# Altium project FIT_PM_Digital_Readout_test_board.PrjPcb (part 1 of 4)
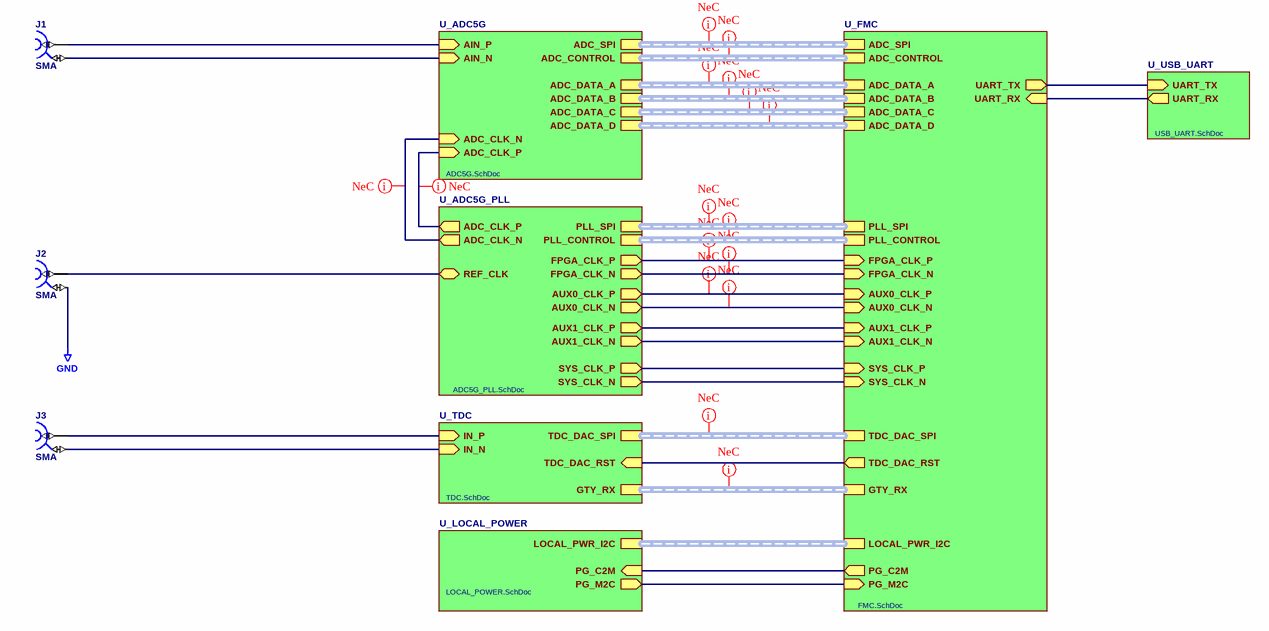
[diagram p0: TOP.SchDoc]
13 sheets, 495 parts. Net scope: hierarchical (ports join the sheet entries above them; power ports are global).
Board file: FIT_TDC_ADC.PcbDoc
Sheets:
  TOP.SchDoc
    U_ADC5G = ADC5G.SchDoc
      U_ADC5G_POWER = ADC5G_POWER.SchDoc
      U_ADC5G_FRONTEND = ADC5G_FRONTEND.SchDoc
      U_ADC5G_DIGITALIO = ADC5G_DIGITALIO.SchDoc
    U_ADC5G_PLL = ADC5G_PLL.SchDoc
    U_FMC = FMC.SchDoc
      U_FMC_EEPROM = FMC_EEPROM.SchDoc
    U_TDC = TDC.SchDoc
      TDC_DL_CH1 = TDC_CH.SchDoc
      TDC_DL_CH2 = TDC_CH.SchDoc
      TDC_DL_CH3 = TDC_CH.SchDoc
      TDC_DL_CH4 = TDC_CH.SchDoc
      TDC_DL_CH5 = TDC_CH.SchDoc
      TDC_DL_CH6 = TDC_CH.SchDoc
      TDC_DL_CH7 = TDC_CH.SchDoc
      TDC_DL_CH8 = TDC_CH.SchDoc
      U_TDC_VTUNE_DAC = TDC_VTUNE_DAC.SchDoc
    U_LOCAL_POWER = LOCAL_POWER.SchDoc
    U_USB_UART = USB_UART.SchDoc

## Sheet TOP.SchDoc: FMC 5GS/s ADC/TDC
size 420 x 297 mm; Author: Agnieszka Bartkowicz; CompanyName: WUT ISE; DrawnBy: Agnieszka Bartkowicz; Engineer: Agnieszka Bartkowicz; Organization: WUT ISE; Address1: PW ISE; Address2: Nowowiejska 15/19 00-665 Warsaw; Address3: gyorka@o2.pl; SheetNumber: 1; SheetTotal: 14; ModifiedBy: -; CheckedDate: -; Title2: Title 2; DivGrp: WUT ISE; Designer: A. Bartkowicz

### Parts
J1  SMA  [SAMTEC_SMA-J-P-H-RA-TH1]
J2  SMA  [SAMTEC_SMA-J-P-H-RA-TH1]
J3  SMA  [SAMTEC_SMA-J-P-H-RA-TH1]

### Sub-sheets
U_ADC5G = ADC5G.SchDoc: ADC_SPI (harness SPI), ADC_CONTROL (harness ADC_CONTROL), ADC_CLK_P (in), ADC_CLK_N (in), ADC_DATA_A (harness ADC_DATA), ADC_DATA_B (harness ADC_DATA), ADC_DATA_C (harness ADC_DATA), ADC_DATA_D (harness ADC_DATA), AIN_N (in), AIN_P (in)
U_ADC5G_PLL = ADC5G_PLL.SchDoc: ADC_CLK_P (out), ADC_CLK_N (out), PLL_SPI (harness PLL_SPI), PLL_CONTROL (harness PLL_CONTROL), FPGA_CLK_P (out), FPGA_CLK_N (out), SYS_CLK_P (out), SYS_CLK_N (out), REF_CLK (bidir), AUX0_CLK_P (out), AUX0_CLK_N (out), AUX1_CLK_P (out), AUX1_CLK_N (out)
U_FMC = FMC.SchDoc: ADC_DATA_A (harness ADC_DATA), ADC_DATA_B (harness ADC_DATA), ADC_DATA_D (harness ADC_DATA), ADC_DATA_C (harness ADC_DATA), ADC_SPI (harness SPI), ADC_CONTROL (harness ADC_CONTROL), PLL_SPI (harness PLL_SPI), PLL_CONTROL (harness PLL_CONTROL), TDC_DAC_SPI (harness SPI), GTY_RX (harness GTY_RX), FPGA_CLK_P (in), FPGA_CLK_N (in), AUX0_CLK_P (in), AUX0_CLK_N (in), PG_M2C (in), PG_C2M (out), AUX1_CLK_N (in), AUX1_CLK_P (in), SYS_CLK_P (in), SYS_CLK_N (in), LOCAL_PWR_I2C (harness I2C), UART_TX (out), UART_RX (in), TDC_DAC_RST (out)
U_LOCAL_POWER = LOCAL_POWER.SchDoc: PG_C2M (in), PG_M2C (out), LOCAL_PWR_I2C (harness I2C)
U_TDC = TDC.SchDoc: TDC_DAC_SPI (harness I2C), IN_P (in), IN_N (in), GTY_RX (harness GTY_RX), TDC_DAC_RST (in)
U_USB_UART = USB_UART.SchDoc: UART_TX (in), UART_RX (out)

### Nets
GND: J2.2
ADC_CLK_N: sheet U_ADC5G/ADC_CLK_N, sheet U_ADC5G_PLL/ADC_CLK_N
ADC_CLK_P: sheet U_ADC5G/ADC_CLK_P, sheet U_ADC5G_PLL/ADC_CLK_P
AIN_N: J1.2 ; sheet U_ADC5G/AIN_N
AIN_P: J1.1 ; sheet U_ADC5G/AIN_P
CARRIER_PWRON: sheet U_FMC/PG_C2M, sheet U_LOCAL_POWER/PG_C2M
CLK0_M2C_N: sheet U_ADC5G_PLL/AUX0_CLK_N, sheet U_FMC/AUX0_CLK_N
CLK0_M2C_P: sheet U_ADC5G_PLL/AUX0_CLK_P, sheet U_FMC/AUX0_CLK_P
CLK1_M2C_N: sheet U_ADC5G_PLL/AUX1_CLK_N, sheet U_FMC/AUX1_CLK_N
CLK1_M2C_P: sheet U_ADC5G_PLL/AUX1_CLK_P, sheet U_FMC/AUX1_CLK_P
CLK2_BIDIR_N: sheet U_ADC5G_PLL/SYS_CLK_N, sheet U_FMC/SYS_CLK_N
CLK2_BIDIR_P: sheet U_ADC5G_PLL/SYS_CLK_P, sheet U_FMC/SYS_CLK_P
DIN_N: J3.2 ; sheet U_TDC/IN_N
DIN_P: J3.1 ; sheet U_TDC/IN_P
GBTCLK0_M2C_N: sheet U_ADC5G_PLL/FPGA_CLK_N, sheet U_FMC/FPGA_CLK_N
GBTCLK0_M2C_P: sheet U_ADC5G_PLL/FPGA_CLK_P, sheet U_FMC/FPGA_CLK_P
HA22_P: sheet U_FMC/TDC_DAC_RST, sheet U_TDC/TDC_DAC_RST
LA20_P: sheet U_FMC/UART_RX, sheet U_USB_UART/UART_RX
LA25_P: sheet U_FMC/UART_TX, sheet U_USB_UART/UART_TX
PG_M2C: sheet U_FMC/PG_M2C, sheet U_LOCAL_POWER/PG_M2C
NetC102_1: J2.1 ; sheet U_ADC5G_PLL/REF_CLK

### Buses and harness runs
harness sheet U_ADC5G/ADC_CONTROL = sheet U_FMC/ADC_CONTROL
harness sheet U_ADC5G/ADC_DATA_A = sheet U_FMC/ADC_DATA_A
harness sheet U_ADC5G/ADC_DATA_B = sheet U_FMC/ADC_DATA_B
harness sheet U_ADC5G/ADC_DATA_C = sheet U_FMC/ADC_DATA_C
harness sheet U_ADC5G/ADC_DATA_D = sheet U_FMC/ADC_DATA_D
harness sheet U_ADC5G/ADC_SPI = sheet U_FMC/ADC_SPI
harness sheet U_ADC5G_PLL/PLL_CONTROL = sheet U_FMC/PLL_CONTROL
harness sheet U_ADC5G_PLL/PLL_SPI = sheet U_FMC/PLL_SPI
harness sheet U_FMC/GTY_RX = sheet U_TDC/GTY_RX
harness sheet U_FMC/LOCAL_PWR_I2C = sheet U_LOCAL_POWER/LOCAL_PWR_I2C
harness sheet U_FMC/TDC_DAC_SPI = sheet U_TDC/TDC_DAC_SPI

### Layout directives
net class ADC_SPI: (no net found under the mark)
net class ADC_CONTROL: (no net found under the mark)
net class ADC_DATA_A: (no net found under the mark)
net class ADC_DATA_B: (no net found under the mark)
net class ADC_DATA_C: (no net found under the mark)
net class ADC_DATA_D: (no net found under the mark)
net class PLL_SPI: (no net found under the mark)
net class PLL_CONTROL: (no net found under the mark)
net class CLOCKS: ADC_CLK_N, ADC_CLK_P, CLK0_M2C_N, CLK0_M2C_P, GBTCLK0_M2C_N, GBTCLK0_M2C_P
net class TRANSCIVERS: (no net found under the mark)
net class I2C: (no net found under the mark)

### Notes on the sheet
- Project/Equipment
- Document
- Designer
- Drawn by
- Check.by
- Copyright WUT ISE 2024.
  This documentation describes Open Hardware and is licensed under the CERN OHL v.2. You may redistribute and modify this documentation under the terms of the CERN OHL v.2. (http://ohwr.org/CERNOHL). This documentation is distributed WITHOUT ANY EXPRESS OR IMPLIED WARRANTY, INCLUDING OF MERCHANTABILITY, SATISFACTORY QUALITY AND FITNESS FOR A PARTICULAR PURPOSE. Please see the CERN OHL v.2 for applicable conditions.
- Contact
- File
- Last Mod.
- Print Date
- Sheet
- Size
- A3
- of
- Rev

### Library data of the parts
J1-J3 = SAMTEC_SMA-J-P-H-RA-TH1: Part Description: 50 Ohms SMA Right Angle Through-hole PCB Jack; Manufacturer: SAMTEC; PressFit: No; Part Number: SAMTEC_SMA-J-P-H-RA-TH1; Component Kind: Standard; Component Type: Standard; Pin Count: 5; Family: SMA; Mounted: Yes; Socket: No; SMD: No; Sense: No; Status: None; Manufacturer Part Number: SMA-J-P-H-RA-TH1; ComponentHeight: 13.8mm; HelpURL: \\cern.ch\dfs\Applications\Altium\Datasheets\SAMTEC_SMA-J-P-H-RA-TH1.pdf; Author: CERN DEM BC; CreateDate: 11.01.2021; LatestRevisionDate: 11.01.2021

## Sheet ADC5G.SchDoc: FMC 5GS/s ADC/TDC
size 420 x 297 mm; Author: Agnieszka Bartkowicz; CompanyName: WUT ISE; DrawnBy: Agnieszka Bartkowicz; Engineer: Agnieszka Bartkowicz; Organization: WUT ISE; Address1: PW ISE; Address2: Nowowiejska 15/19 00-665 Warsaw; Address3: gyorka@o2.pl; SheetNumber: 2; SheetTotal: 13; ModifiedBy: -; CheckedDate: -; Title2: Title 2; DivGrp: WUT ISE; Designer: A. Bartkowicz
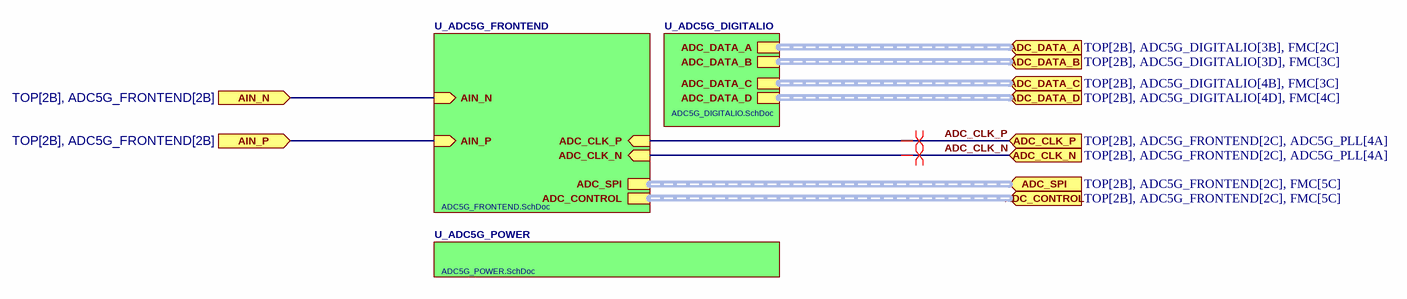
[diagram p1: ADC5G.SchDoc]

### Sub-sheets
U_ADC5G_DIGITALIO = ADC5G_DIGITALIO.SchDoc: ADC_DATA_A (harness ADC_DATA), ADC_DATA_B (harness ADC_DATA), ADC_DATA_D (harness ADC_DATA), ADC_DATA_C (harness ADC_DATA)
U_ADC5G_FRONTEND = ADC5G_FRONTEND.SchDoc: AIN_N (in), AIN_P (in), ADC_CLK_P (in), ADC_CLK_N (in), ADC_SPI (harness SPI), ADC_CONTROL (harness ADC_CONTROL)
U_ADC5G_POWER = ADC5G_POWER.SchDoc: no entries

### Ports
ADC_CLK_N (in, see TOP[2B], ADC5G_FRONTEND[2C], ADC5G_PLL[4A]), ADC_CLK_P (in, see TOP[2B], ADC5G_FRONTEND[2C], ADC5G_PLL[4A]), ADC_CONTROL (in, harness ADC_CONTROL, see TOP[2B], ADC5G_FRONTEND[2C], FMC[5C]), ADC_DATA_A (in, harness ADC_DATA, see TOP[2B], ADC5G_DIGITALIO[3B], FMC[2C]), ADC_DATA_B (in, harness ADC_DATA, see TOP[2B], ADC5G_DIGITALIO[3D], FMC[3C]), ADC_DATA_C (in, harness ADC_DATA, see TOP[2B], ADC5G_DIGITALIO[4B], FMC[3C]), ADC_DATA_D (in, harness ADC_DATA, see TOP[2B], ADC5G_DIGITALIO[4D], FMC[4C]), ADC_SPI (in, harness SPI, see TOP[2B], ADC5G_FRONTEND[2C], FMC[5C]), AIN_N (in, see TOP[2B], ADC5G_FRONTEND[2B]), AIN_P (in, see TOP[2B], ADC5G_FRONTEND[2B])

### Nets
ADC_CLK_N: port ADC_CLK_N, sheet U_ADC5G_FRONTEND/ADC_CLK_N
ADC_CLK_P: port ADC_CLK_P, sheet U_ADC5G_FRONTEND/ADC_CLK_P
AIN_N: port AIN_N, sheet U_ADC5G_FRONTEND/AIN_N
AIN_P: port AIN_P, sheet U_ADC5G_FRONTEND/AIN_P

### Buses and harness runs
harness port ADC_CONTROL = sheet U_ADC5G_FRONTEND/ADC_CONTROL
harness port ADC_DATA_A = sheet U_ADC5G_DIGITALIO/ADC_DATA_A
harness port ADC_DATA_B = sheet U_ADC5G_DIGITALIO/ADC_DATA_B
harness port ADC_DATA_C = sheet U_ADC5G_DIGITALIO/ADC_DATA_C
harness port ADC_DATA_D = sheet U_ADC5G_DIGITALIO/ADC_DATA_D
harness port ADC_SPI = sheet U_ADC5G_FRONTEND/ADC_SPI

### Layout directives
differential pair: ADC_CLK_N, ADC_CLK_P

### Notes on the sheet
- Project/Equipment
- Document
- Designer
- Drawn by
- Check.by
- Copyright WUT ISE 2024.
  This documentation describes Open Hardware and is licensed under the CERN OHL v.2. You may redistribute and modify this documentation under the terms of the CERN OHL v.2. (http://ohwr.org/CERNOHL). This documentation is distributed WITHOUT ANY EXPRESS OR IMPLIED WARRANTY, INCLUDING OF MERCHANTABILITY, SATISFACTORY QUALITY AND FITNESS FOR A PARTICULAR PURPOSE. Please see the CERN OHL v.2 for applicable conditions.
- Contact
- File
- Last Mod.
- Print Date
- Sheet
- Size
- A3
- of
- Rev

## Sheet ADC5G_POWER.SchDoc: FMC 5GS/s ADC/TDC
size 420 x 297 mm; Author: Agnieszka Bartkowicz; CompanyName: WUT ISE; DrawnBy: Agnieszka Bartkowicz; Engineer: Agnieszka Bartkowicz; Organization: WUT ISE; Address1: PW ISE; Address2: Nowowiejska 15/19 00-665 Warsaw; Address3: gyorka@o2.pl; SheetNumber: 5; SheetTotal: 13; ModifiedBy: -; CheckedDate: -; Title2: Title 2; DivGrp: WUT ISE; Designer: A. Bartkowicz
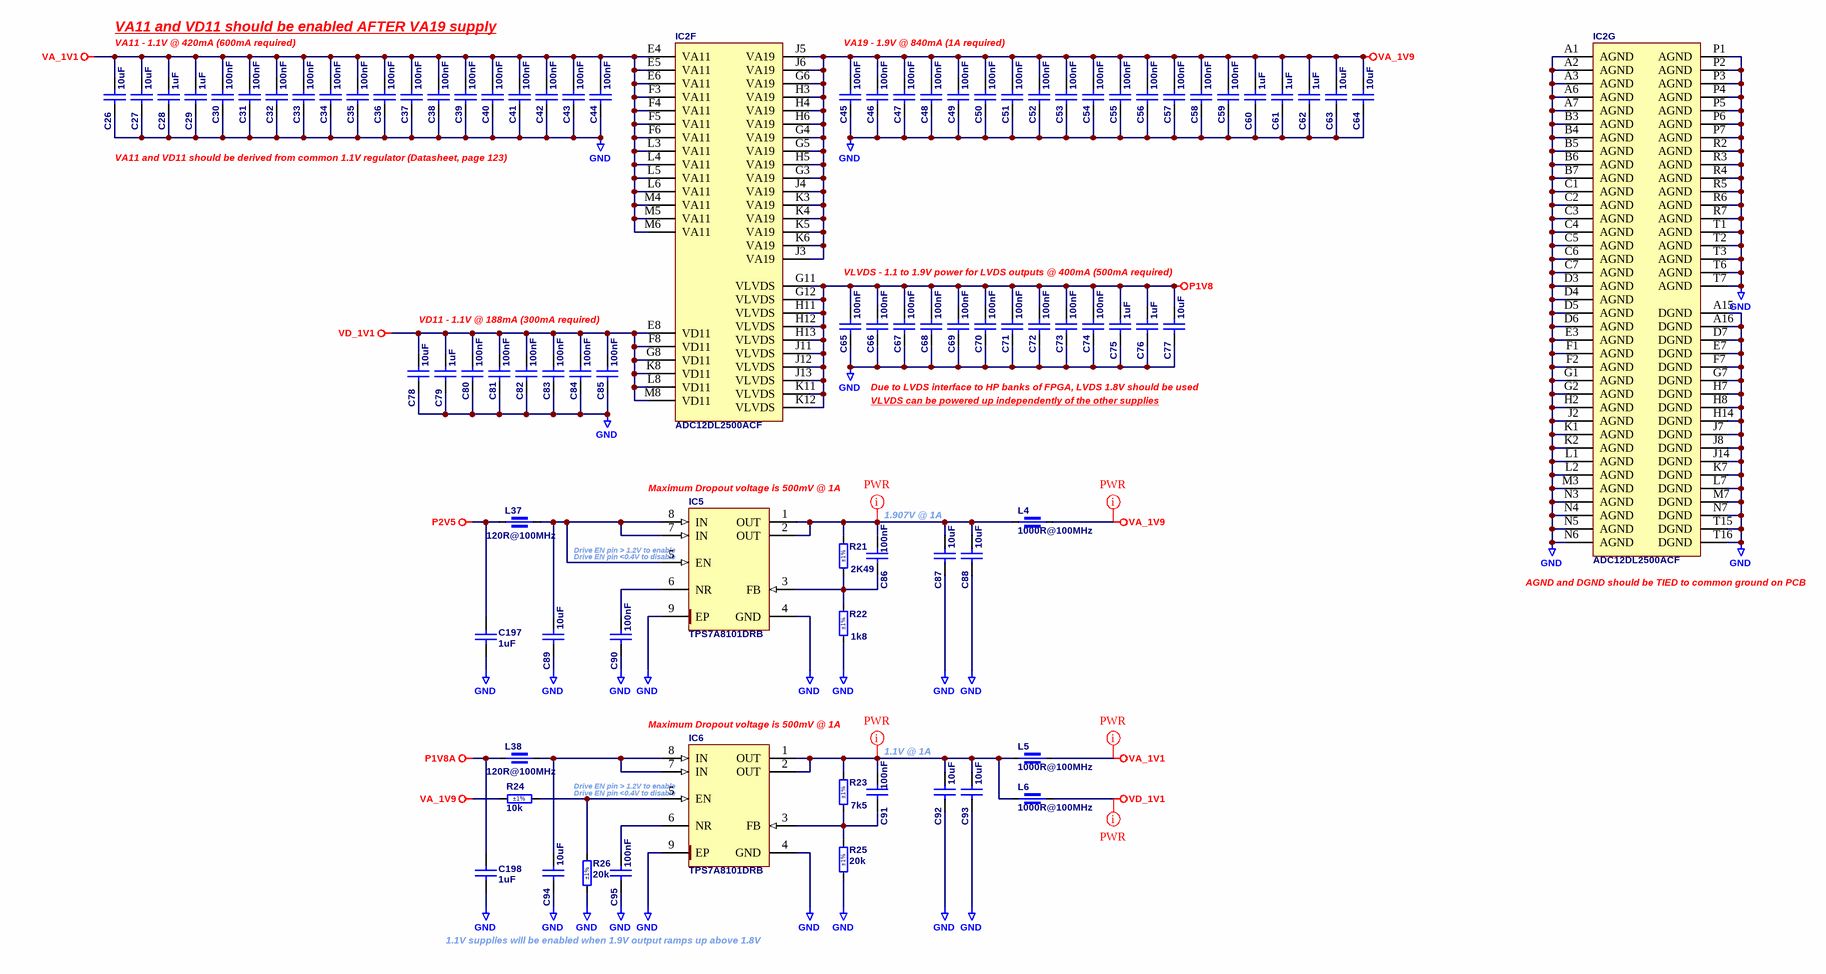
[diagram p2: ADC5G_POWER.SchDoc]

### Parts
C26  10uF  [CAPC1608X90N]
C27  10uF  [CAPC1608X90N]
C28  1uF  [CAPC1005X55N]
C29  1uF  [CAPC1005X55N]
C30  100nF  [CAPC0603X33N]
C31  100nF  [CAPC0603X33N]
C32  100nF  [CAPC0603X33N]
C33  100nF  [CAPC0603X33N]
C34  100nF  [CAPC0603X33N]
C35  100nF  [CAPC0603X33N]
C36  100nF  [CAPC0603X33N]
C37  100nF  [CAPC0603X33N]
C38  100nF  [CAPC0603X33N]
C39  100nF  [CAPC0603X33N]
C40  100nF  [CAPC0603X33N]
C41  100nF  [CAPC0603X33N]
C42  100nF  [CAPC0603X33N]
C43  100nF  [CAPC0603X33N]
C44  100nF  [CAPC0603X33N]
C45  100nF  [CAPC0603X33N]
C46  100nF  [CAPC0603X33N]
C47  100nF  [CAPC0603X33N]
C48  100nF  [CAPC0603X33N]
C49  100nF  [CAPC0603X33N]
C50  100nF  [CAPC0603X33N]
C51  100nF  [CAPC0603X33N]
C52  100nF  [CAPC0603X33N]
C53  100nF  [CAPC0603X33N]
C54  100nF  [CAPC0603X33N]
C55  100nF  [CAPC0603X33N]
C56  100nF  [CAPC0603X33N]
C57  100nF  [CAPC0603X33N]
C58  100nF  [CAPC0603X33N]
C59  100nF  [CAPC0603X33N]
C60  1uF  [CAPC1005X55N]
C61  1uF  [CAPC1005X55N]
C62  1uF  [CAPC1005X55N]
C63  10uF  [CAPC1608X90N]
C64  10uF  [CAPC1608X90N]
C65  100nF  [CAPC0603X33N]
C66  100nF  [CAPC0603X33N]
C67  100nF  [CAPC0603X33N]
C68  100nF  [CAPC0603X33N]
C69  100nF  [CAPC0603X33N]
C70  100nF  [CAPC0603X33N]
C71  100nF  [CAPC0603X33N]
C72  100nF  [CAPC0603X33N]
C73  100nF  [CAPC0603X33N]
C74  100nF  [CAPC0603X33N]
C75  1uF  [CAPC1005X55N]
C76  1uF  [CAPC1005X55N]
C77  10uF  [CAPC1608X90N]
C78  10uF  [CAPC1608X90N]
C79  1uF  [CAPC1005X55N]
C80  100nF  [CAPC0603X33N]
C81  100nF  [CAPC0603X33N]
C82  100nF  [CAPC0603X33N]
C83  100nF  [CAPC0603X33N]
C84  100nF  [CAPC0603X33N]
C85  100nF  [CAPC0603X33N]
C86  100nF  [CAPC1005X55N]
C87  10uF  [CAPC1608X90N]
C88  10uF  [CAPC1608X90N]
C89  10uF  [CAPC1608X90N]
C90  100nF  [CAPC1005X55N]
C91  100nF  [CAPC1005X55N]
C92  10uF  [CAPC1608X90N]
C93  10uF  [CAPC1608X90N]
C94  10uF  [CAPC1608X90N]
C95  100nF  [CAPC1005X55N]
C197  1uF  [CAPC1005X55N]
C198  1uF  [CAPC1005X55N]
IC2  ADC12DL2500ACF  [BGA256C100P16X16_1700X1700X331]  (parts F,G of 7)
IC5  TPS7A8101DRB  [TEXAS_DRB(S-PVSON-N8)]
IC6  TPS7A8101DRB  [TEXAS_DRB(S-PVSON-N8)]
L4  1000R@100MHz  [INDC1608X95N]
L5  1000R@100MHz  [INDC1608X95N]
L6  1000R@100MHz  [INDC1608X95N]
L37  120R@100MHz  [INDC1005X55N]
L38  120R@100MHz  [INDC1005X55N]
R21  2K49  Tolerance: ±1%  [RESC1005X40N]
R22  1k8  Tolerance: ±1%  [RESC1005X40N]
R23  7k5  Tolerance: ±1%  [RESC1005X40N]
R24  10k  Tolerance: ±1%  [RESC1005X40N]
R25  20k  Tolerance: ±1%  [RESC1005X40N]
R26  20k  Tolerance: ±1%  [RESC1005X40N]

### Nets
GND: C26.1 C27.1 C28.1 C29.1 C30.1 C31.1 C32.1 C33.1 C34.1 C35.1 C36.1 C37.1 C38.1 C39.1 C40.1 C41.1 C42.1 C43.1 C44.1 C45.1 C46.1 C47.1 C48.1 C49.1 C50.1 C51.1 C52.1 C53.1 C54.1 C55.1 C56.1 C57.1 C58.1 C59.1 C60.1 C61.1 C62.1 C63.1 C64.1 C65.1 C66.1 C67.1 C68.1 C69.1 C70.1 C71.1 C72.1 C73.1 C74.1 C75.1 C76.1 C77.1 C78.1 C79.1 C80.1 C81.1 C82.1 C83.1 C84.1 C85.1 C87.1 C88.1 C89.1 C90.1 C92.1 C93.1 C94.1 C95.1 C197.1 C198.1 IC2.A1(AGND) IC2.A2(AGND) IC2.A3(AGND) IC2.A6(AGND) IC2.A7(AGND) IC2.A15(DGND) IC2.A16(DGND) IC2.B3(AGND) IC2.B4(AGND) IC2.B5(AGND) IC2.B6(AGND) IC2.B7(AGND) IC2.C1(AGND) IC2.C2(AGND) IC2.C3(AGND) IC2.C4(AGND) IC2.C5(AGND) IC2.C6(AGND) IC2.C7(AGND) IC2.D3(AGND) IC2.D4(AGND) IC2.D5(AGND) IC2.D6(AGND) IC2.D7(DGND) IC2.E3(AGND) IC2.E7(DGND) IC2.F1(AGND) IC2.F2(AGND) IC2.F7(DGND) IC2.G1(AGND) IC2.G2(AGND) IC2.G7(DGND) IC2.H2(AGND) IC2.H7(DGND) IC2.H8(DGND) IC2.H14(DGND) IC2.J2(AGND) IC2.J7(DGND) IC2.J8(DGND) IC2.J14(DGND) IC2.K1(AGND) IC2.K2(AGND) IC2.K7(DGND) IC2.L1(AGND) IC2.L2(AGND) IC2.L7(DGND) IC2.M3(AGND) IC2.M7(DGND) IC2.N3(AGND) IC2.N4(AGND) IC2.N5(AGND) IC2.N6(AGND) IC2.N7(DGND) IC2.P1(AGND) IC2.P2(AGND) IC2.P3(AGND) IC2.P4(AGND) IC2.P5(AGND) IC2.P6(AGND) IC2.P7(AGND) IC2.R2(AGND) IC2.R3(AGND) IC2.R4(AGND) IC2.R5(AGND) IC2.R6(AGND) IC2.R7(AGND) IC2.T1(AGND) IC2.T2(AGND) IC2.T3(AGND) IC2.T6(AGND) IC2.T7(AGND) IC2.T15(DGND) IC2.T16(DGND) IC5.4(GND) IC5.9(EP) IC6.4(GND) IC6.9(EP) R22.1 R25.1 R26.1
P1V8: C65.2 C66.2 C67.2 C68.2 C69.2 C70.2 C71.2 C72.2 C73.2 C74.2 C75.2 C76.2 C77.2 IC2.G11(VLVDS) IC2.G12(VLVDS) IC2.H11(VLVDS) IC2.H12(VLVDS) IC2.H13(VLVDS) IC2.J11(VLVDS) IC2.J12(VLVDS) IC2.J13(VLVDS) IC2.K11(VLVDS) IC2.K12(VLVDS)
P1V8A: C198.2 L38.1
P2V5: C197.2 L37.1
VA_1V1: C26.2 C27.2 C28.2 C29.2 C30.2 C31.2 C32.2 C33.2 C34.2 C35.2 C36.2 C37.2 C38.2 C39.2 C40.2 C41.2 C42.2 C43.2 C44.2 IC2.E4(VA11) IC2.E5(VA11) IC2.E6(VA11) IC2.F3(VA11) IC2.F4(VA11) IC2.F5(VA11) IC2.F6(VA11) IC2.L3(VA11) IC2.L4(VA11) IC2.L5(VA11) IC2.L6(VA11) IC2.M4(VA11) IC2.M5(VA11) IC2.M6(VA11) L5.2
VA_1V9: C45.2 C46.2 C47.2 C48.2 C49.2 C50.2 C51.2 C52.2 C53.2 C54.2 C55.2 C56.2 C57.2 C58.2 C59.2 C60.2 C61.2 C62.2 C63.2 C64.2 IC2.G3(VA19) IC2.G4(VA19) IC2.G5(VA19) IC2.G6(VA19) IC2.H3(VA19) IC2.H4(VA19) IC2.H5(VA19) IC2.H6(VA19) IC2.J3(VA19) IC2.J4(VA19) IC2.J5(VA19) IC2.J6(VA19) IC2.K3(VA19) IC2.K4(VA19) IC2.K5(VA19) IC2.K6(VA19) L4.2 R24.1
VD_1V1: C78.2 C79.2 C80.2 C81.2 C82.2 C83.2 C84.2 C85.2 IC2.E8(VD11) IC2.F8(VD11) IC2.G8(VD11) IC2.K8(VD11) IC2.L8(VD11) IC2.M8(VD11) L6.2
NetC86_1: C86.1 IC5.3(FB) R21.1 R22.2
NetC86_2: C86.2 C87.2 C88.2 IC5.1(OUT) IC5.2(OUT) L4.1 R21.2
NetC89_2: C89.2 IC5.5(EN) IC5.7(IN) IC5.8(IN) L37.2
NetC90_2: C90.2 IC5.6(NR)
NetC91_1: C91.1 IC6.3(FB) R23.1 R25.2
NetC91_2: C91.2 C92.2 C93.2 IC6.1(OUT) IC6.2(OUT) L5.1 L6.1 R23.2
NetC94_2: C94.2 IC6.7(IN) IC6.8(IN) L38.2
NetC95_2: C95.2 IC6.6(NR)
NetIC6_5: IC6.5(EN) R24.2 R26.2

### Layout directives
net class PWR: NetC86_2, NetC91_2, VA_1V1, VA_1V9, VD_1V1

### Notes on the sheet
- VA11 - 1.1V @ 420mA (600mA required)
- VA11 and VD11 should be enabled AFTER VA19 supply
- VA19 - 1.9V @ 840mA (1A required)
- VA11 and VD11 should be derived from common 1.1V regulator (Datasheet, page 123)
- VLVDS - 1.1 to 1.9V power for LVDS outputs @ 400mA (500mA required)
- VD11 - 1.1V @ 188mA (300mA required)
- Due to LVDS interface to HP banks of FPGA, LVDS 1.8V should be used
- VLVDS can be powered up independently of the other supplies
- (near IC5) Maximum Dropout voltage is 500mV @ 1A
- (near IC5) Drive EN pin > 1.2V to enable
- 1.907V @ 1A
- (near IC5) Drive EN pin <0.4V to disable
- (near IC2) AGND and DGND should be TIED to common ground on PCB
- (near IC6) Maximum Dropout voltage is 500mV @ 1A
- 1.1V @ 1A
- (near IC6) Drive EN pin > 1.2V to enable
- (near IC6) Drive EN pin <0.4V to disable
- 1.1V supplies will be enabled when 1.9V output ramps up above 1.8V
- Project/Equipment
- Document
- Designer
- Drawn by
- Check.by
- Copyright WUT ISE 2024.
  This documentation describes Open Hardware and is licensed under the CERN OHL v.2. You may redistribute and modify this documentation under the terms of the CERN OHL v.2. (http://ohwr.org/CERNOHL). This documentation is distributed WITHOUT ANY EXPRESS OR IMPLIED WARRANTY, INCLUDING OF MERCHANTABILITY, SATISFACTORY QUALITY AND FITNESS FOR A PARTICULAR PURPOSE. Please see the CERN OHL v.2 for applicable conditions.
- Contact
- File
- Last Mod.
- Print Date
- Sheet
- Size
- A3
- of
- Rev

### Library data of the parts
C26 C27 C63 C64 C77 C78 C87-C89 C92-C94 = CC0603_10UF_16V_10%_X5R_MURATA_GRT188R61C106KE13: Non-polarised capacitor; Part Description: AEC-Q200 Compliant Chip Multilayer Ceramic Capacitor; Manufacturer: MURATA; Voltage: 16V; TC: X5R; Tolerance: ±10%; Part Number: CC0603_10UF_16V_10%_X5R_MURATA_GRT188R61C106KE13; Component Kind: Standard; Component Type: Standard; Pin Count: 2; Value: 10uF; Status: None; Manufacturer Part Number: GRT188R61C106KE13; Case: 0603; Mounted: Yes; Socket: No; SMD: Yes; Sense: No; ComponentHeight: 0.9mm; HelpURL: \\cern.ch\dfs\Applications\Altium\Datasheets\CC0603_MURATA_GRT188R61C106KE13.pdf; Author: CERN DEM HF; CreateDate: 16.06.2022; LatestRevisionDate: 17.06.2022
C28 C29 C60-C62 C75 C76 C79 = CC0402_1UF_16V_10%_X5R: Non-polarised capacitor; Part Description: SMD Multilayer Chip Ceramic Capacitor; Manufacturer: GENERIC; Manufacturer1 Part Number: C1005X5R1C105KT; Voltage: 16V; TC: X5R; Tolerance: ±10%; Part Number: CC0402_1UF_16V_10%_X5R; Component Kind: Standard; Component Type: Standard; Pin Count: 2; Value: 1uF; Status: Preferred; Manufacturer Part Number: CC0402_1UF_16V_10%_X5R; Case: 0402; Mounted: Yes; Socket: No; SMD: Yes; Sense: No; Manufacturer1 Example: TDK; Manufacturer1 ComponentHeight: 0.55mm; HelpURL: \\cern.ch\dfs\Applications\Altium\Datasheets\CC0402_X5R_TDK_C.pdf; Author: CERN DEM JLC; CreateDate: 25.10.2012; LatestRevisionDate: 25.10.2012
C30-C59 C65-C74 C80-C85 = CC0201_100NF_6.3V_10%_X7R: Non-polarised capacitor; Part Description: SMD Multilayer Chip Ceramic Capacitor; Manufacturer: GENERIC; Manufacturer1 Part Number: CC0201KRX7R5BB104; Voltage: 6.3V; TC: X7R; Tolerance: ±10%; Part Number: CC0201_100NF_6.3V_10%_X7R; Component Kind: Standard; Component Type: Standard; Pin Count: 2; Value: 100nF; Status: Not Recommended; Manufacturer Part Number: CC0201_100NF_6.3V_10%_X7R; Case: 0201; Mounted: Yes; Socket: No; SMD: Yes; Sense: No; Manufacturer1 Example: YAGEO PHYCOMP; Manufacturer1 ComponentHeight: 0.33mm; HelpURL: \\cern.ch\dfs\Applications\Altium\Datasheets\CC0201_X7R_YAGEO_6.3VTO50V.pdf; Author: CERN DEM BC; CreateDate: 20.11.2020; LatestRevisionDate: 20.11.2020
C86 C90 C91 C95 = CC0402_100NF_16V_10%_X5R: Non-polarised capacitor; Part Description: SMD Multilayer Chip Ceramic Capacitor; Manufacturer: GENERIC; Manufacturer1 Part Number: GRM155R61C104KA88D; Voltage: 16V; TC: X5R; Tolerance: ±10%; Part Number: CC0402_100NF_16V_10%_X5R; Component Kind: Standard; Component Type: Standard; Pin Count: 2; Value: 100nF; Status: None; Manufacturer Part Number: CC0402_100NF_16V_10%_X5R; Case: 0402; Mounted: Yes; Socket: No; SMD: Yes; Sense: No; Manufacturer1 Example: MURATA; Manufacturer1 ComponentHeight: 0.55mm; HelpURL: \\cern.ch\dfs\Applications\Altium\Datasheets\CC0402_X5R_MURATA_GRM.pdf; Author: CERN DEM JLC; CreateDate: 10.12.2013; LatestRevisionDate: 10.12.2013
C197 C198 = CC0402_1UF_25V_10%_X5R: Non-polarised capacitor; Part Description: SMD Multilayer Chip Ceramic Capacitor; Manufacturer: GENERIC; Manufacturer1 Part Number: C1005X5R1E105K050; Voltage: 25V; TC: X5R; Tolerance: ±10%; Part Number: CC0402_1UF_25V_10%_X5R; Component Kind: Standard; Component Type: Standard; Pin Count: 2; Value: 1uF; Status: Preferred; Manufacturer Part Number: CC0402_1UF_25V_10%_X5R; Case: 0402; Mounted: Yes; Socket: No; SMD: Yes; Sense: No; Manufacturer1 Example: TDK; Manufacturer1 ComponentHeight: 0.55mm; HelpURL: \\cern.ch\dfs\Applications\Altium\Datasheets\CC0402_X5R_TDK_C.pdf; Author: CERN DEM BC; CreateDate: 17.02.2020; LatestRevisionDate: 17.02.2020
IC2 = ADC12DL2500ACF: Single-Supply, Multichannel, 125kSPS, 24-Bit, Sigma-Delta ADC with ±10V Inputs; Part Description: 1.5 GSPS Dual-Channel or 1, 3, 5GSPS Single-Channel,12-Bit Analog-to-Digital Converters (ADC) With LVDS Interface; Manufacturer: TEXAS INSTRUMENTS; PressFit: No; Bonding: No; Part Number: ADC12DL2500ACF; Component Kind: Standard; Component Type: Standard; Device: ADC12DL2500ACF; PackageDescription: BGA, 1.00mm Pitch, Square; 156 Pin, 16 Columns X 16 Rows, 17.0mm X 17.0mm X 3.31mm H body, IPC Medium Density; Manufacturer Part Number: ADC12DL2500ACF; Pin Count: 256; Case: BGA256; Mounted: Yes; Socket: No; SMD: Yes; Sense: No; ComponentHeight: 3.31mm; Author: CERN DEM HF; HelpURL: \\cern.ch\dfs\Applications\Altium\Datasheets\ADC12DLX500ACF.pdf; CreateDate: 04.12.2024; LatestRevisionDate: 04.12.2024
IC5 IC6 = TPS7A8101DRB: 0.8V to 6V, 1A, Low-Noise, Wide-Bandwidth, High PSRR, Low-Dropout Linear Regulator; Manufacturer: TEXAS INSTRUMENTS; PressFit: No; Bonding: No; Part Number: TPS7A8101DRB; Component Kind: Standard; Component Type: Standard; Device: TPS7A8101DRB; PackageDescription: TEXAS Case Style DRB (S-PVSON-N8), SON, 0.65mm Pitch; 8 Pin, 3.00mm W X 3.00mm L X 1.00mm H body (w/Thermal Tab 1.60 X 1.85mm); Part Description: 0.8V to 6V, 1A, Low-Noise, Wide-Bandwidth, High PSRR, Low-Dropout Linear Regulator; Manufacturer Part Number: TPS7A8101DRB; Pin Count: 9; Case: SON8; Mounted: Yes; Socket: No; SMD: Yes; Sense: No; ComponentHeight: 1mm; HelpURL: \\cern.ch\dfs\Applications\Altium\Datasheets\TPS7A8101DRB.pdf; Author: CERN DEM BC; CreateDate: 18.02.2019; LatestRevisionDate: 18.02.2019
L4-L6 = IND0603_MURATA_BLM18KG102SN1: Part Description: SMD Chip Ferrite Bead, Automotive; Manufacturer: MURATA; Manufacturer Part Number: BLM18KG102WH1; Power: 1A; Resistance: 0.2R; Tolerance: ±25%; Part Number: IND0603_MURATA_BLM18KG102SN1; Component Kind: Standard; Component Type: Standard; Pin Count: 2; Value: 1000R@100MHz; Case: 0603; Mounted: Yes; Socket: No; SMD: Yes; Sense: No; ComponentHeight: 0.95mm; HelpURL: \\cern.ch\dfs\Applications\Altium\Datasheets\IND0603_MURATA_BLM18KG102SN1.pdf; Author: CERN DEM HF; CreateDate: 15.12.2022; LatestRevisionDate: 15.12.2022
L37 L38 = IND0402_MURATA_BLM15PX121SN1D: Part Description: SMD EMIFIL Chip Ferrite Bead; Manufacturer: MURATA; Power: 2A; Resistance: 0.055R; Tolerance: ±25%; Part Number: IND0402_MURATA_BLM15PX121SN1D; Component Kind: Standard; Component Type: Standard; Pin Count: 2; Value: 120R@100MHz; Manufacturer Part Number: BLM15PX121SN1D; Case: 0402; Mounted: Yes; Socket: No; SMD: Yes; Sense: No; ComponentHeight: 0.55mm; HelpURL: \\cern.ch\dfs\Applications\Altium\Datasheets\IND0402_MURATA_BLM15PX.pdf; Author: CERN DEM JMW; CreateDate: 19.02.2014; LatestRevisionDate: 25.10.2018
R21 = R0402_2K49_1%_0.063W_100PPM: Resistor - 1%; Part Description: General Purpose Thick Film Chip Resistor; Manufacturer: GENERIC; Manufacturer1 Part Number: CRCW04022K49FK; Power: 0.063W; TC: ±100ppm/°C; PressFit: No; Part Number: R0402_2K49_1%_0.063W_100PPM; Component Kind: Standard; Component Type: Standard; Pin Count: 2; Value: 2K49; Status: None; Manufacturer Part Number: R0402_2K49_1%_0.063W_100PPM; Case: 0402; Mounted: Yes; Sense: No; Socket: No; SMD: Yes; Manufacturer1 Example: VISHAY; Manufacturer1 ComponentHeight: 0.4mm; HelpURL: \\cern.ch\dfs\Applications\Altium\Datasheets\R0402_VISHAY_CRCW e3.pdf; Author: CERN DEM BC; CreateDate: 10.01.2020; LatestRevisionDate: 10.01.2020
R22 = R0402_1K8_1%_0.0625W_100PPM: Resistor - 1%; Part Description: General Purpose Thick Film Chip Resistor; Manufacturer: GENERIC; Manufacturer1 Part Number: 232270671802L; TC: ±100ppm/°C; PressFit: No; Part Number: R0402_1K8_1%_0.0625W_100PPM; Component Kind: Standard; Component Type: Standard; Pin Count: 2; Value: 1k8; Status: Not Recommended; Power: 0.0625W; Manufacturer Part Number: R0402_1K8_1%_0.0625W_100PPM; Case: 0402; Mounted: Yes; Sense: No; Socket: No; SMD: Yes; Manufacturer1 Example: YAGEO PHYCOMP; Manufacturer1 ComponentHeight: 0.4mm; HelpURL: \\cern.ch\dfs\Applications\Altium\Datasheets\R0402_Phycomp_RC0402.pdf; Author: CERN DEM JLC; CreateDate: 03.12.2007; LatestRevisionDate: 17.10.2012
R23 = R0402_7K5_1%_0.0625W_100PPM: Resistor - 1%; Part Description: General Purpose Thick Film Chip Resistor; Manufacturer: GENERIC; Manufacturer1 Part Number: 232270677502L; TC: ±100ppm/°C; PressFit: No; Part Number: R0402_7K5_1%_0.0625W_100PPM; Component Kind: Standard; Component Type: Standard; Pin Count: 2; Value: 7k5; Status: Not Recommended; Power: 0.0625W; Manufacturer Part Number: R0402_7K5_1%_0.0625W_100PPM; Case: 0402; Mounted: Yes; Sense: No; Socket: No; SMD: Yes; Manufacturer1 Example: YAGEO PHYCOMP; Manufacturer1 ComponentHeight: 0.4mm; HelpURL: \\cern.ch\dfs\Applications\Altium\Datasheets\R0402_Phycomp_RC0402.pdf; Author: CERN DEM JLC; CreateDate: 03.12.2007; LatestRevisionDate: 17.10.2012
R24 = R0402_10K_1%_0.0625W_100PPM: Resistor - 1%; Part Description: General Purpose Thick Film Chip Resistor; Manufacturer: GENERIC; Manufacturer1 Part Number: 232270671003L; TC: ±100ppm/°C; PressFit: No; Part Number: R0402_10K_1%_0.0625W_100PPM; Component Kind: Standard; Component Type: Standard; Pin Count: 2; Value: 10k; Status: Not Recommended; Power: 0.0625W; Manufacturer Part Number: R0402_10K_1%_0.0625W_100PPM; Case: 0402; Mounted: Yes; Sense: No; Socket: No; SMD: Yes; Manufacturer1 Example: YAGEO PHYCOMP; Manufacturer1 ComponentHeight: 0.4mm; HelpURL: \\cern.ch\dfs\Applications\Altium\Datasheets\R0402_Phycomp_RC0402.pdf; Author: CERN DEM JLC; CreateDate: 03.12.2007; LatestRevisionDate: 17.10.2012
R25 R26 = R0402_20K_1%_0.0625W_100PPM: Resistor - 1%; Part Description: General Purpose Thick Film Chip Resistor; Manufacturer: GENERIC; Manufacturer1 Part Number: 232270672003L; TC: ±100ppm/°C; PressFit: No; Part Number: R0402_20K_1%_0.0625W_100PPM; Component Kind: Standard; Component Type: Standard; Pin Count: 2; Value: 20k; Status: Not Recommended; Power: 0.0625W; Manufacturer Part Number: R0402_20K_1%_0.0625W_100PPM; Case: 0402; Mounted: Yes; Sense: No; Socket: No; SMD: Yes; Manufacturer1 Example: YAGEO PHYCOMP; Manufacturer1 ComponentHeight: 0.4mm; HelpURL: \\cern.ch\dfs\Applications\Altium\Datasheets\R0402_Phycomp_RC0402.pdf; Author: CERN DEM JLC; CreateDate: 03.12.2007; LatestRevisionDate: 17.10.2012

## Sheet ADC5G_FRONTEND.SchDoc: FMC 5GS/s ADC/TDC
size 420 x 297 mm; Author: Agnieszka Bartkowicz; CompanyName: WUT ISE; DrawnBy: Agnieszka Bartkowicz; Engineer: Agnieszka Bartkowicz; Organization: WUT ISE; Address1: PW ISE; Address2: Nowowiejska 15/19 00-665 Warsaw; Address3: gyorka@o2.pl; SheetNumber: 3; SheetTotal: 14; ModifiedBy: -; CheckedDate: -; Title2: Title 2; DivGrp: WUT ISE; Designer: A. Bartkowicz
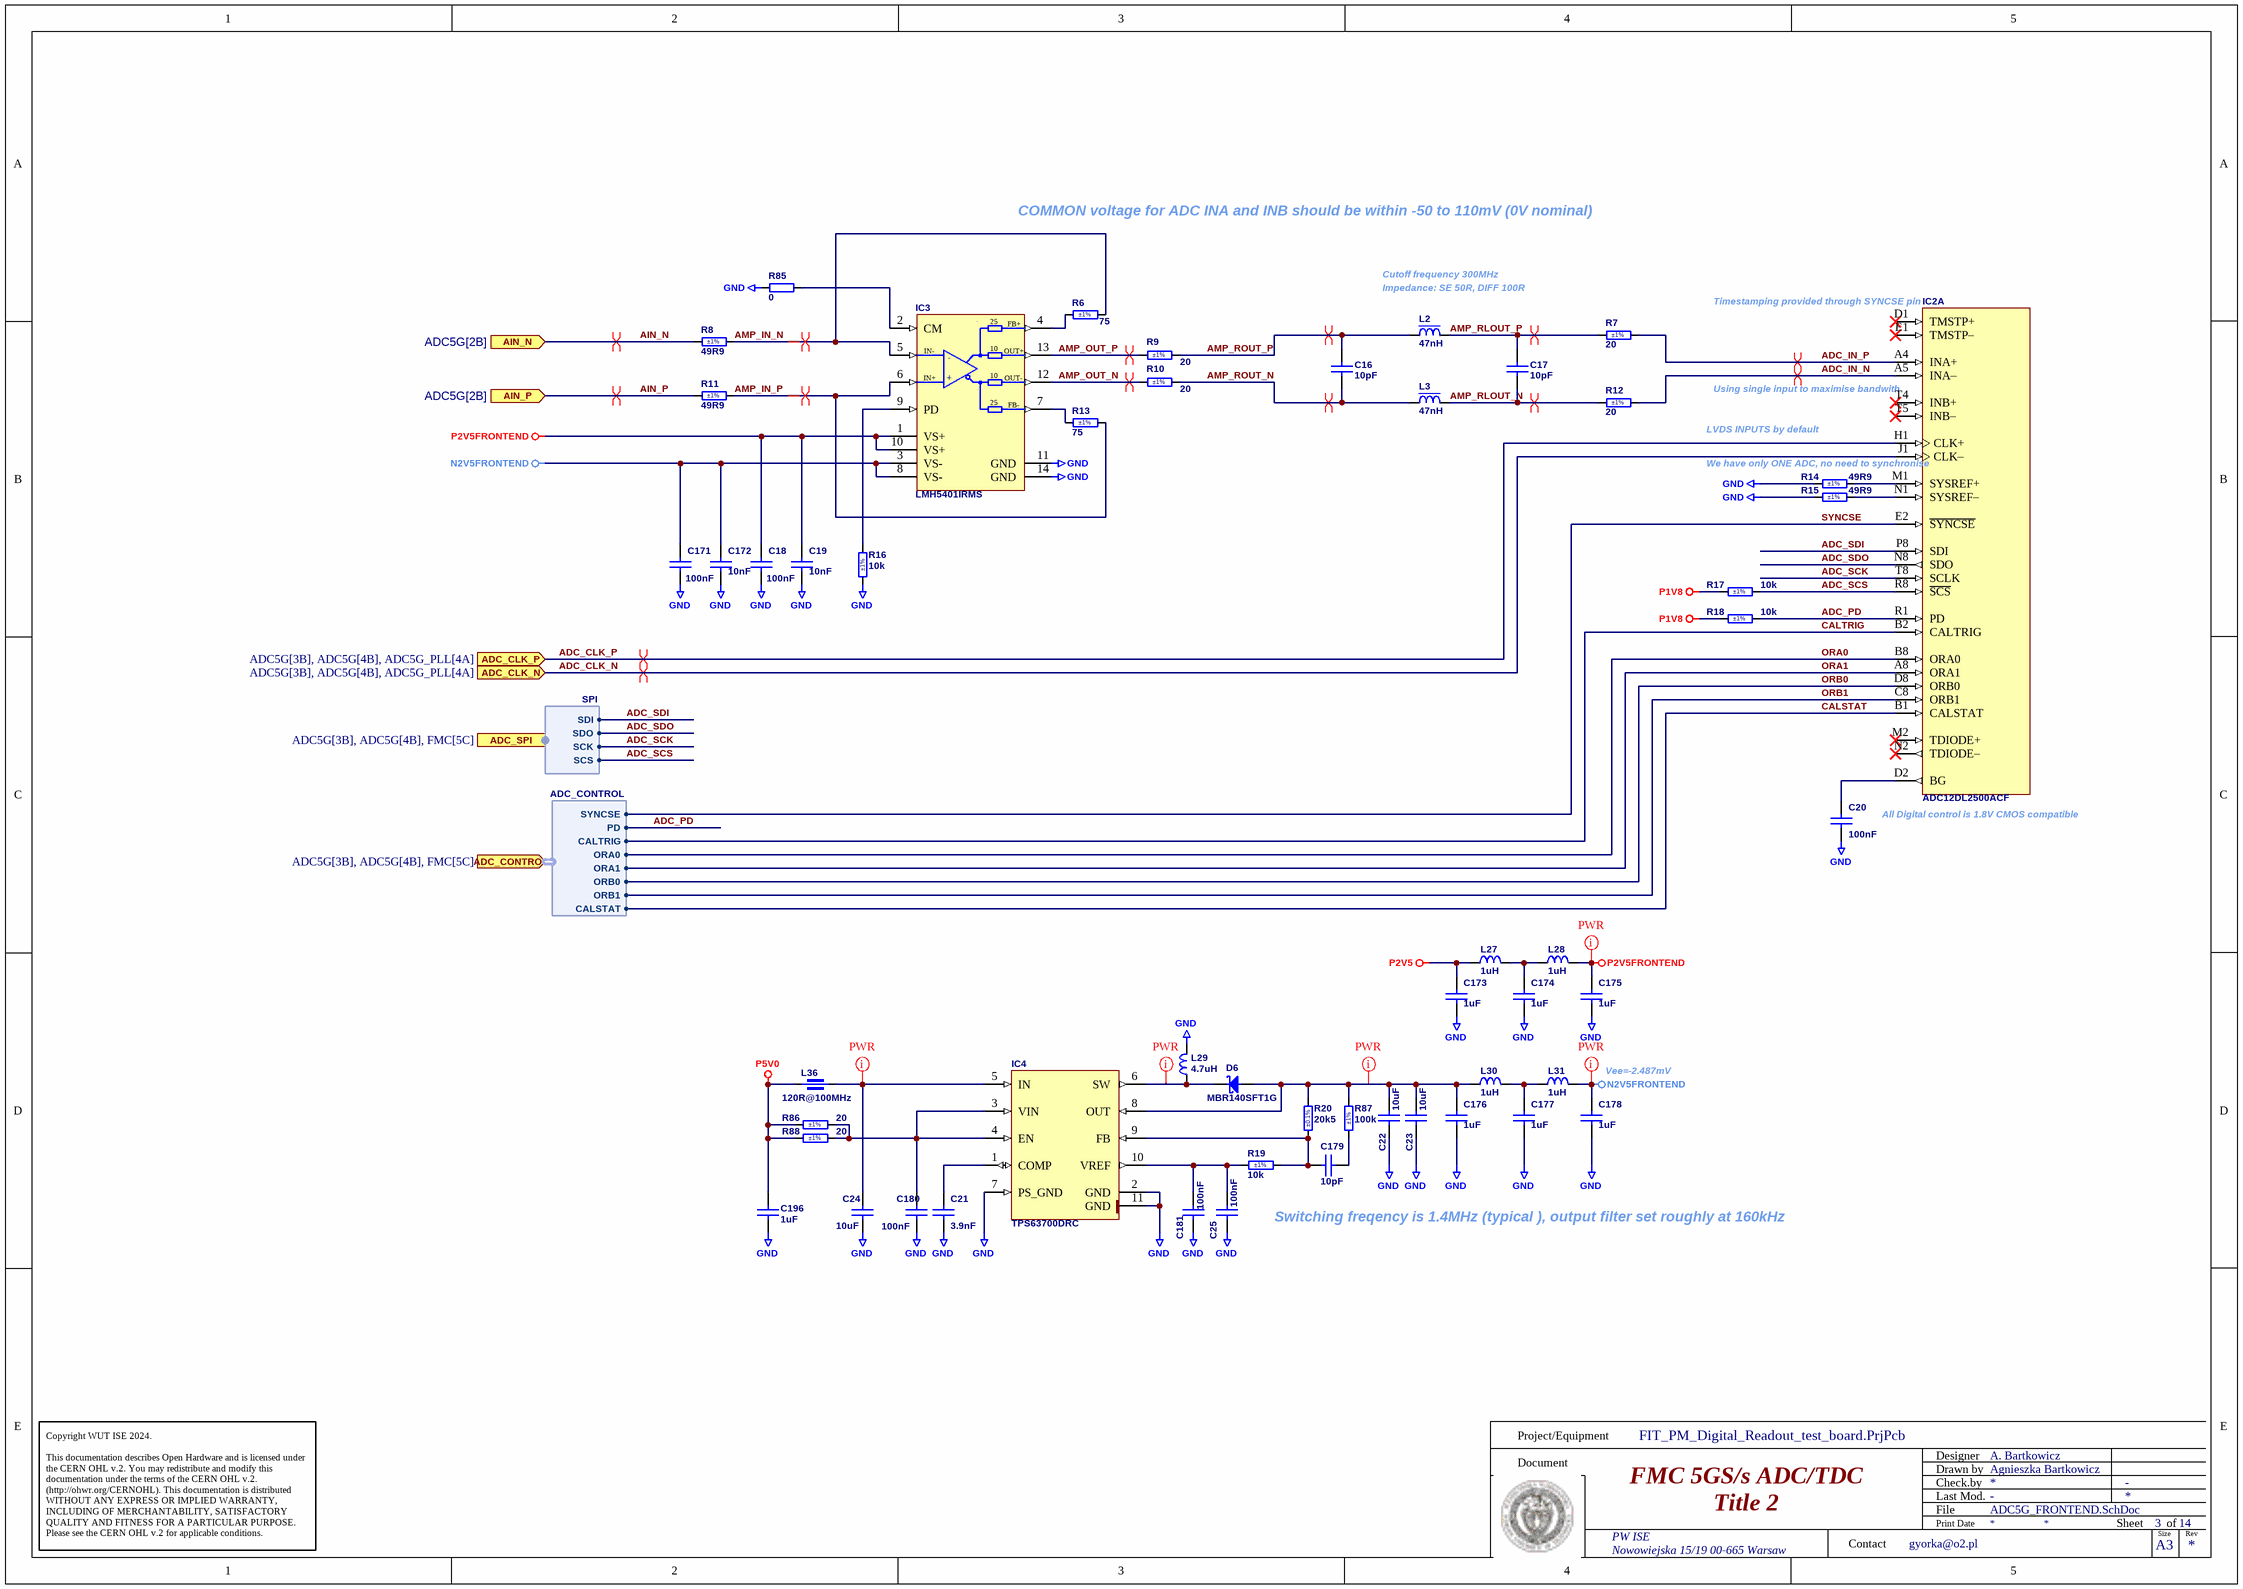
[diagram p3: ADC5G_FRONTEND.SchDoc]

### Parts
C16  10pF  [CAPC1005X55N]
C17  10pF  [CAPC1005X55N]
C18  100nF  [CAPC1005X55N]
C19  10nF  [CAPC1005X55N]
C20  100nF  [CAPC0603X33N]
C21  3.9nF  [CAPC1005X55N]
C22  10uF  [CAPC1608X90N]
C23  10uF  [CAPC1608X90N]
C24  10uF  [CAPC1608X90N]
C25  100nF  [CAPC1005X55N]
C171  100nF  [CAPC1005X55N]
C172  10nF  [CAPC1005X55N]
C173  1uF  [CAPC1005X55N]
C174  1uF  [CAPC1005X55N]
C175  1uF  [CAPC1005X55N]
C176  1uF  [CAPC1005X55N]
C177  1uF  [CAPC1005X55N]
C178  1uF  [CAPC1005X55N]
C179  10pF  [CAPC1005X55N]
C180  100nF  [CAPC1005X55N]
C181  100nF  [CAPC1005X55N]
C196  1uF  [CAPC1005X55N]
D6  MBR140SFT1G  [SOD-123FL]
IC2  ADC12DL2500ACF  [BGA256C100P16X16_1700X1700X331]  (part A of 7)
IC3  LMH5401IRMS  [QFN50P250X250X60-14N]
IC4  TPS63700DRC  [TEXAS_DRC (S-PVSON-N10)]
L2  47nH  [IND_MURATA_LQW15AN_00]
L3  47nH  [IND_MURATA_LQW15AN_00]
L27  1uH  [INDC2012X110N]
L28  1uH  [INDC2012X110N]
L29  4.7uH  [IND_COILCRAFT_EPL3015]
L30  1uH  [INDC2012X110N]
L31  1uH  [INDC2012X110N]
L36  120R@100MHz  [INDC1005X55N]
R6  75  Tolerance: ±1%  [RESC1005X40N]
R7  20  Tolerance: ±1%  [RESC1005X40N]
R8  49R9  Tolerance: ±1%  [RESC1005X40N]
R9  20  Tolerance: ±1%  [RESC1005X40N]
R10  20  Tolerance: ±1%  [RESC1005X40N]
R11  49R9  Tolerance: ±1%  [RESC1005X40N]
R12  20  Tolerance: ±1%  [RESC1005X40N]
R13  75  Tolerance: ±1%  [RESC1005X40N]
R14  49R9  Tolerance: ±1%  [RESC1005X40N]
R15  49R9  Tolerance: ±1%  [RESC1005X40N]
R16  10k  Tolerance: ±1%  [RESC1005X40N]
R17  10k  Tolerance: ±1%  [RESC1005X40N]
R18  10k  Tolerance: ±1%  [RESC1005X40N]
R19  10k  Tolerance: ±1%  [RESC1005X40N]
R20  20k5  Tolerance: ±0.1%  [RESC1608X55N]
R85  0  [RESC1005X40N]
R86  20  Tolerance: ±1%  [RESC1005X40N]
R87  100k  Tolerance: ±1%  [RESC1005X40N]
R88  20  Tolerance: ±1%  [RESC1005X40N]

### Ports
ADC_CLK_N (in, see ADC5G[3B], ADC5G[4B], ADC5G_PLL[4A]), ADC_CLK_P (in, see ADC5G[3B], ADC5G[4B], ADC5G_PLL[4A]), ADC_CONTROL (in, harness ADC_CONTROL, see ADC5G[3B], ADC5G[4B], FMC[5C]), ADC_SPI (in, harness SPI, see ADC5G[3B], ADC5G[4B], FMC[5C]), AIN_N (in, see ADC5G[2B]), AIN_P (in, see ADC5G[2B])

### Harnesses
SPI: SDI, SDO, SCK, SCS
ADC_CONTROL: SYNCSE, PD, CALTRIG, ORA0, ORA1, ORB0, ORB1, CALSTAT

### Nets
GND: C18.1 C19.1 C20.1 C21.1 C22.1 C23.1 C24.1 C25.1 C171.1 C172.1 C173.1 C174.1 C175.1 C176.1 C177.1 C178.1 C180.1 C181.1 C196.1 IC3.11(GND) IC3.14(GND) IC4.2(GND) IC4.7(PS_GND) IC4.11(GND) L29.2 R14.1 R15.1 R16.1 R85.1
N2V5FRONTEND: C171.2 C172.2 C178.2 IC3.3(VS-) IC3.8(VS-) L31.2
P1V8: R17.1 R18.1
P2V5: C173.2 L27.1
P2V5FRONTEND: C18.2 C19.2 C175.2 IC3.1(VS+) IC3.10(VS+) L28.2
P5V0: C196.2 L36.1 R86.2 R88.2
ADC_SCS: IC2.R8(~{SCS}) R17.2 ; port ADC_SPI.SCS
SYNCSE: IC2.E2(~{SYNCSE}) ; port ADC_CONTROL.SYNCSE
ADC_CLK_N: IC2.J1(CLK–) ; port ADC_CLK_N
ADC_CLK_P: IC2.H1(CLK+) ; port ADC_CLK_P
ADC_IN_N: IC2.A5(INA–) R12.2
ADC_IN_P: IC2.A4(INA+) R7.2
ADC_PD: IC2.R1(PD) R18.2 ; port ADC_CONTROL.PD
ADC_SCK: IC2.T8(SCLK) ; port ADC_SPI.SCK
ADC_SDI: IC2.P8(SDI) ; port ADC_SPI.SDI
ADC_SDO: IC2.N8(SDO) ; port ADC_SPI.SDO
AIN_N: R8.1 ; port AIN_N
AIN_P: R11.1 ; port AIN_P
AMP_IN_N: IC3.5(IN-) R6.2 R8.2
AMP_IN_P: IC3.6(IN+) R11.2 R13.2
AMP_OUT_N: IC3.12(OUT-) R10.1
AMP_OUT_P: IC3.13(OUT+) R9.1
AMP_RLOUT_N: C17.1 L3.2 R12.1
AMP_RLOUT_P: C17.2 L2.2 R7.1
AMP_ROUT_N: C16.1 L3.1 R10.2
AMP_ROUT_P: C16.2 L2.1 R9.2
CALSTAT: IC2.B1(CALSTAT) ; port ADC_CONTROL.CALSTAT
CALTRIG: IC2.B2(CALTRIG) ; port ADC_CONTROL.CALTRIG
ORA0: IC2.B8(ORA0) ; port ADC_CONTROL.ORA0  [project net HB11_P]
ORA1: IC2.A8(ORA1) ; port ADC_CONTROL.ORA1  [project net HB12_P]
ORB0: IC2.D8(ORB0) ; port ADC_CONTROL.ORB0  [project net HB14_P]
ORB1: IC2.C8(ORB1) ; port ADC_CONTROL.ORB1  [project net HB15_P]
NetC20_2: C20.2 IC2.D2(BG)
NetC21_2: C21.2 IC4.1(COMP)
NetC22_2: C22.2 C23.2 C176.2 D6.2(A) IC4.8(OUT) L30.1 R20.1 R87.2
NetC24_2: C24.2 IC4.5(IN) L36.2
NetC25_2: C25.2 C181.2 IC4.10(VREF) R19.1
NetC174_2: C174.2 L27.2 L28.1
NetC177_2: C177.2 L30.2 L31.1
NetC179_1: C179.1 IC4.9(FB) R19.2 R20.2
NetC179_2: C179.2 R87.1
NetC180_2: C180.2 IC4.3(VIN) IC4.4(EN) R86.1 R88.1
NetD6_1: D6.1(C) IC4.6(SW) L29.1
NetIC2_M1: IC2.M1(SYSREF+) R14.2
NetIC2_N1: IC2.N1(SYSREF–) R15.2
NetIC3_2: IC3.2(CM) R85.2
NetIC3_4: IC3.4(FB+) R6.1
NetIC3_7: IC3.7(FB-) R13.1
NetIC3_9: IC3.9(PD) R16.2

Not connected (* = marked no-connect by the designer): IC2 D1(TMSTP+)* E1(TMSTP–)* M2(TDIODE+)* N2(TDIODE–)* T4(INB+)* T5(INB–)*

### Layout directives
differential pair: ADC_CLK_N, ADC_CLK_P, ADC_IN_N, ADC_IN_P, AIN_N, AIN_P, AMP_IN_N, AMP_IN_P, AMP_OUT_N, AMP_OUT_P, AMP_RLOUT_N, AMP_RLOUT_P, AMP_ROUT_N, AMP_ROUT_P
net class PWR: N2V5FRONTEND, NetC22_2, NetC24_2, NetD6_1, P2V5FRONTEND

### Notes on the sheet
- COMMON voltage for ADC INA and INB should be within -50 to 110mV (0V nominal)
- Cutoff frequency 300MHz
- (near L2) Impedance: SE 50R, DIFF 100R
- (near IC2) Timestamping provided through SYNCSE pin
- (near IC2) Using single input to maximise bandwith
- LVDS INPUTS by default
- (near IC2) We have only ONE ADC, no need to synchronise
- All Digital control is 1.8V CMOS compatible
- Vee=-2.487mV
- Switching freqency is 1.4MHz (typical ), output filter set roughly at 160kHz
- Project/Equipment
- Document
- Designer
- Drawn by
- Check.by
- Copyright WUT ISE 2024.
  This documentation describes Open Hardware and is licensed under the CERN OHL v.2. You may redistribute and modify this documentation under the terms of the CERN OHL v.2. (http://ohwr.org/CERNOHL). This documentation is distributed WITHOUT ANY EXPRESS OR IMPLIED WARRANTY, INCLUDING OF MERCHANTABILITY, SATISFACTORY QUALITY AND FITNESS FOR A PARTICULAR PURPOSE. Please see the CERN OHL v.2 for applicable conditions.
- Contact
- File
- Last Mod.
- Print Date
- Sheet
- Size
- A3
- of
- Rev
- (in symbol LMH5401IRMS) 25; -; +

### Library data of the parts
C16 C17 C179 = CC0402_10PF_50V_5%_C0G: Non-polarised capacitor; Part Description: SMD Multilayer Chip Ceramic Capacitor; Manufacturer: GENERIC; Manufacturer1 Part Number: C0402C100J5GACTU; Voltage: 50V; TC: C0G/NP0; Tolerance: ±5%; Part Number: CC0402_10PF_50V_5%_C0G; Component Kind: Standard; Component Type: Standard; Pin Count: 2; Value: 10pF; Status: Preferred; Manufacturer Part Number: CC0402_10PF_50V_5%_C0G; Case: 0402; Mounted: Yes; Socket: No; SMD: Yes; Sense: No; Manufacturer1 Example: KEMET; Manufacturer1 ComponentHeight: 0.55mm; HelpURL: \\cern.ch\dfs\Applications\Altium\Datasheets\CC0402_C0G_KEMET_(Commercial Grade).pdf; Author: CERN DEM JLC; CreateDate: 03.12.2007; LatestRevisionDate: 22.04.2015
C18 C25 C171 C180 C181 = CC0402_100NF_16V_10%_X5R: as C86 on sheet ADC5G_POWER; Part Number: CC0402_100NF_16V_10%_X5R; Component Kind: Standard; Component Type: Standard; Pin Count: 2; Value: 100nF; Status: None; Manufacturer Part Number: CC0402_100NF_16V_10%_X5R; Case: 0402; Mounted: Yes; Socket: No; SMD: Yes; Sense: No; Manufacturer1 Example: MURATA; Manufacturer1 ComponentHeight: 0.55mm; HelpURL: \\cern.ch\dfs\Applications\Altium\Datasheets\CC0402_X5R_MURATA_GRM.pdf; Author: CERN DEM JLC; CreateDate: 10.12.2013; LatestRevisionDate: 10.12.2013
C19 C172 = CC0402_10NF_50V_10%_X7R: Non-polarised capacitor; Part Description: SMD Multilayer Chip Ceramic Capacitor; Manufacturer: GENERIC; Manufacturer1 Part Number: GRM155R71H103KA88D; Voltage: 50V; TC: X7R; Tolerance: ±10%; Part Number: CC0402_10NF_50V_10%_X7R; Component Kind: Standard; Component Type: Standard; Pin Count: 2; Value: 10nF; Status: None; Manufacturer Part Number: CC0402_10NF_50V_10%_X7R; Case: 0402; Mounted: Yes; Socket: No; SMD: Yes; Sense: No; Manufacturer1 Example: MURATA; Manufacturer1 ComponentHeight: 0.55mm; HelpURL: \\cern.ch\dfs\Applications\Altium\Datasheets\CC0402_X7R_MURATA_GRM.pdf; Author: CERN DEM MR; CreateDate: 08.01.2016; LatestRevisionDate: 08.01.2016
C20 = CC0201_100NF_6.3V_10%_X7R: as C30 on sheet ADC5G_POWER; Part Number: CC0201_100NF_6.3V_10%_X7R; Component Kind: Standard; Component Type: Standard; Pin Count: 2; Value: 100nF; Status: Not Recommended; Manufacturer Part Number: CC0201_100NF_6.3V_10%_X7R; Case: 0201; Mounted: Yes; Socket: No; SMD: Yes; Sense: No; Manufacturer1 Example: YAGEO PHYCOMP; Manufacturer1 ComponentHeight: 0.33mm; HelpURL: \\cern.ch\dfs\Applications\Altium\Datasheets\CC0201_X7R_YAGEO_6.3VTO50V.pdf; Author: CERN DEM BC; CreateDate: 20.11.2020; LatestRevisionDate: 20.11.2020
C21 = CC0402_3.9NF_50V_5%_X7R: Non-polarised capacitor; Part Description: SMD Multilayer Chip Ceramic Capacitor; Manufacturer: GENERIC; Manufacturer1 Part Number: CC0402JRX7R9BB392; Voltage: 50V; TC: X7R; Tolerance: ±5%; Part Number: CC0402_3.9NF_50V_5%_X7R; Component Kind: Standard; Component Type: Standard; Pin Count: 2; Value: 3.9nF; Status: Preferred; Manufacturer Part Number: CC0402_3.9NF_50V_5%_X7R; Case: 0402; Mounted: Yes; Socket: No; SMD: Yes; Sense: No; Manufacturer1 Example: YAGEO PHYCOMP; Manufacturer1 ComponentHeight: 0.55mm; HelpURL: \\cern.ch\dfs\Applications\Altium\Datasheets\CC0402_X7R_YAGEO_6.3VTO50V.pdf; Author: CERN DEM BC; CreateDate: 14.07.2020; LatestRevisionDate: 14.07.2020
C22-C24 = CC0603_10UF_16V_10%_X5R_MURATA_GRT188R61C106KE13: as C26 on sheet ADC5G_POWER; Part Number: CC0603_10UF_16V_10%_X5R_MURATA_GRT188R61C106KE13; Component Kind: Standard; Component Type: Standard; Pin Count: 2; Value: 10uF; Status: None; Manufacturer Part Number: GRT188R61C106KE13; Case: 0603; Mounted: Yes; Socket: No; SMD: Yes; Sense: No; ComponentHeight: 0.9mm; HelpURL: \\cern.ch\dfs\Applications\Altium\Datasheets\CC0603_MURATA_GRT188R61C106KE13.pdf; Author: CERN DEM HF; CreateDate: 16.06.2022; LatestRevisionDate: 17.06.2022
C173-C178 = CC0402_1UF_16V_10%_X5R: as C28 on sheet ADC5G_POWER; Part Number: CC0402_1UF_16V_10%_X5R; Component Kind: Standard; Component Type: Standard; Pin Count: 2; Value: 1uF; Status: Preferred; Manufacturer Part Number: CC0402_1UF_16V_10%_X5R; Case: 0402; Mounted: Yes; Socket: No; SMD: Yes; Sense: No; Manufacturer1 Example: TDK; Manufacturer1 ComponentHeight: 0.55mm; HelpURL: \\cern.ch\dfs\Applications\Altium\Datasheets\CC0402_X5R_TDK_C.pdf; Author: CERN DEM JLC; CreateDate: 25.10.2012; LatestRevisionDate: 25.10.2012
C196 = CC0402_1UF_25V_10%_X5R: as C197 on sheet ADC5G_POWER; Part Number: CC0402_1UF_25V_10%_X5R; Component Kind: Standard; Component Type: Standard; Pin Count: 2; Value: 1uF; Status: Preferred; Manufacturer Part Number: CC0402_1UF_25V_10%_X5R; Case: 0402; Mounted: Yes; Socket: No; SMD: Yes; Sense: No; Manufacturer1 Example: TDK; Manufacturer1 ComponentHeight: 0.55mm; HelpURL: \\cern.ch\dfs\Applications\Altium\Datasheets\CC0402_X5R_TDK_C.pdf; Author: CERN DEM BC; CreateDate: 17.02.2020; LatestRevisionDate: 17.02.2020
D6 = MBR140SFT1G: Schottky Diode; Part Description: Schottky Power Rectifier; Manufacturer: ON SEMICONDUCTOR; Voltage: 40V; Power: 1A; PressFit: No; Bonding: No; Part Number: MBR140SFT1G; Component Kind: Standard; Component Type: Standard; Device: MBR140SFT1G; PackageDescription: Small Outline Diode Flat Lead (SOD-123FL), Body; 2.70mm L X 1.65mm W X 1.0mm H; Manufacturer Part Number: MBR140SF; Pin Count: 2; Case: SOD-123FL; Mounted: Yes; Socket: No; SMD: Yes; Sense: No; ComponentHeight: 1.0mm; HelpURL: \\cern.ch\dfs\Applications\Altium\Datasheets\MBR140SFT1G.pdf; Author: CERN DEM JLC; CreateDate: 06.04.2009; LatestRevisionDate: 24.05.2022
IC2 = ADC12DL2500ACF: as IC2 on sheet ADC5G_POWER; Part Number: ADC12DL2500ACF; Component Kind: Standard; Component Type: Standard; Device: ADC12DL2500ACF; PackageDescription: BGA, 1.00mm Pitch, Square; 156 Pin, 16 Columns X 16 Rows, 17.0mm X 17.0mm X 3.31mm H body, IPC Medium Density; Manufacturer Part Number: ADC12DL2500ACF; Pin Count: 256; Case: BGA256; Mounted: Yes; Socket: No; SMD: Yes; Sense: No; ComponentHeight: 3.31mm; Author: CERN DEM HF; HelpURL: \\cern.ch\dfs\Applications\Altium\Datasheets\ADC12DLX500ACF.pdf; CreateDate: 04.12.2024; LatestRevisionDate: 04.12.2024
IC3 = LMH5401IRMS: Low-Noise, Low-Power, 8-GHz Fully Differential Amplifier; Manufacturer: TEXAS INSTRUMENTS; PressFit: No; Bonding: No; Part Number: LMH5401IRMS; Component Kind: Standard; Component Type: Standard; Device: LMH5401IRMS; PackageDescription: QFN, 0.50mm Pitch, Square, 14 pin, 2.50mm L X 2.50mm W X 0.60mm H body, IPC Medium Density; Part Description: Low-Noise, Low-Power, 8-GHz Fully Differential Amplifier; Manufacturer Part Number: LMH5401IRMS; Pin Count: 14; Case: QFN14; Mounted: Yes; Socket: No; SMD: Yes; Sense: No; ComponentHeight: 0.6mm; Author: CERN DEM MR; HelpURL: \\cern.ch\dfs\Applications\Altium\Datasheets\LMH5401IRMS.pdf; CreateDate: 08.08.2019; LatestRevisionDate: 08.08.2019
IC4 = TPS63700DRC: DC-DC Inverter; Manufacturer: TEXAS INSTRUMENTS; PressFit: No; Bonding: No; Part Number: TPS63700DRC; Component Kind: Standard; Component Type: Standard; Device: TPS63700DRC; PackageDescription: TEXAS Case Style DRC (S-PVSON-N10), SON, 0.50mm Pitch; 10 Pin, 3.00mm W  X 3.00mm L X 1.00mm H body, (w/Thermal Tab 1.75 X 2.50 mm); Part Description: DC-DC Inverter; Manufacturer Part Number: TPS63700DRC; Pin Count: 11; Case: SON10; Mounted: Yes; Socket: No; SMD: Yes; Sense: No; ComponentHeight: 1mm; HelpURL: \\cern.ch\dfs\Applications\Altium\Datasheets\TPS63700DRC.pdf; Author: CERN DEM BC; CreateDate: 18.05.2020; LatestRevisionDate: 18.05.2020
L2 L3 = IND0402_47NH_2%_MURATA_LQW15AN47NG00: Inductor With Core; Part Description: Wire Wound RF Inductor; Manufacturer: MURATA; Power: 210mA; Resistance: 1R08; Tolerance: ±2%; Part Number: IND0402_47NH_2%_MURATA_LQW15AN47NG00; Component Kind: Standard; Component Type: Standard; Pin Count: 2; Value: 47nH; Manufacturer Part Number: LQW15AN47NG00; Case: 0402; Mounted: Yes; Socket: No; SMD: Yes; Sense: No; ComponentHeight: 0.6mm; HelpURL: \\cern.ch\dfs\Applications\Altium\Datasheets\IND_MURATA_LQW15AN47NG00.pdf; Author: CERN DEM HF; CreateDate: 05.08.2022; LatestRevisionDate: 05.08.2022
L27 L28 L30 L31 = IND0805_1UH_20%_WURTH_74479775210: Inductor; Part Description: SMD-Power Inductance (WE-PMI Series); Manufacturer: WURTH ELEKTRONIK; Power: 800mA; Resistance: 0.1R; Tolerance: ±20%; Part Number: IND0805_1UH_20%_WURTH_74479775210; Component Kind: Standard; Component Type: Standard; Pin Count: 2; Value: 1uH; Manufacturer Part Number: 74479775210; Case: 0805; Mounted: Yes; Socket: No; SMD: Yes; Sense: No; ComponentHeight: 1.2mm; HelpURL: \\cern.ch\dfs\Applications\Altium\Datasheets\IND0805_WURTH_74479775210.pdf; Author: CERN DEM JLC; CreateDate: 10.10.2012; LatestRevisionDate: 08.04.2014
L29 = IND_4.7UH_20%_COILCRAFT_EPL3015: Inductor; Part Description: Shielded SMD Power Inductor; Manufacturer Part Number: EPL3015-472ML; Power: 1A; Resistance: 0.145R; Tolerance: ±20%; Part Number: IND_4.7UH_20%_COILCRAFT_EPL3015; Component Kind: Standard; Component Type: Standard; Pin Count: 2; Value: 4.7uH; Manufacturer: COILCRAFT; Mounted: Yes; Socket: No; SMD: Yes; Sense: No; ComponentHeight: 1.55mm; HelpURL: \\cern.ch\dfs\Applications\Altium\Datasheets\IND_COILCRAFT_EPL3015.pdf; Author: CERN DEM BC; CreateDate: 27.02.2017; LatestRevisionDate: 27.02.2017
L36 = IND0402_MURATA_BLM15PX121SN1D: as L37 on sheet ADC5G_POWER; Part Number: IND0402_MURATA_BLM15PX121SN1D; Component Kind: Standard; Component Type: Standard; Pin Count: 2; Value: 120R@100MHz; Manufacturer Part Number: BLM15PX121SN1D; Case: 0402; Mounted: Yes; Socket: No; SMD: Yes; Sense: No; ComponentHeight: 0.55mm; HelpURL: \\cern.ch\dfs\Applications\Altium\Datasheets\IND0402_MURATA_BLM15PX.pdf; Author: CERN DEM JMW; CreateDate: 19.02.2014; LatestRevisionDate: 25.10.2018
R6 R13 = R0402_75R_1%_0.0625W_100PPM: Resistor - 1%; Part Description: General Purpose Thick Film Chip Resistor; Manufacturer: GENERIC; Manufacturer1 Part Number: 232270677509L; TC: ±100ppm/°C; PressFit: No; Part Number: R0402_75R_1%_0.0625W_100PPM; Component Kind: Standard; Component Type: Standard; Pin Count: 2; Value: 75; Status: Not Recommended; Power: 0.0625W; Manufacturer Part Number: R0402_75R_1%_0.0625W_100PPM; Case: 0402; Mounted: Yes; Sense: No; Socket: No; SMD: Yes; Manufacturer1 Example: YAGEO PHYCOMP; Manufacturer1 ComponentHeight: 0.4mm; HelpURL: \\cern.ch\dfs\Applications\Altium\Datasheets\R0402_Phycomp_RC0402.pdf; Author: CERN DEM JLC; CreateDate: 03.12.2007; LatestRevisionDate: 17.10.2012
R7 R9 R10 R12 R86 R88 = R0402_20R_1%_0.0625W_100PPM: Resistor - 1%; Part Description: General Purpose Thick Film Chip Resistor; Manufacturer: GENERIC; Manufacturer1 Part Number: 232270672009L; TC: ±100ppm/°C; PressFit: No; Part Number: R0402_20R_1%_0.0625W_100PPM; Component Kind: Standard; Component Type: Standard; Pin Count: 2; Value: 20; Status: Not Recommended; Power: 0.0625W; Manufacturer Part Number: R0402_20R_1%_0.0625W_100PPM; Case: 0402; Mounted: Yes; Sense: No; Socket: No; SMD: Yes; Manufacturer1 Example: YAGEO PHYCOMP; Manufacturer1 ComponentHeight: 0.4mm; HelpURL: \\cern.ch\dfs\Applications\Altium\Datasheets\R0402_Phycomp_RC0402.pdf; Author: CERN DEM JLC; CreateDate: 03.12.2007; LatestRevisionDate: 17.10.2012
R8 R11 R14 R15 = R0402_49R9_1%_0.0625W_100PPM: Resistor - 1%; Part Description: General Purpose Thick Film Chip Resistor; Manufacturer: GENERIC; Manufacturer1 Part Number: 232270674999L or RC0402FR-0749R9L; TC: ±100ppm/°C; PressFit: No; Part Number: R0402_49R9_1%_0.0625W_100PPM; Component Kind: Standard; Component Type: Standard; Pin Count: 2; Value: 49R9; Status: Not Recommended; Power: 0.0625W; Manufacturer Part Number: R0402_49R9_1%_0.0625W_100PPM; Case: 0402; Mounted: Yes; Sense: No; Socket: No; SMD: Yes; Manufacturer1 Example: YAGEO PHYCOMP; Manufacturer1 ComponentHeight: 0.4mm; HelpURL: \\cern.ch\dfs\Applications\Altium\Datasheets\R0402_Phycomp_RC0402.pdf; Author: CERN DEM JLC; CreateDate: 24.10.2012; LatestRevisionDate: 24.10.2012
R16-R19 = R0402_10K_1%_0.0625W_100PPM: as R24 on sheet ADC5G_POWER; Part Number: R0402_10K_1%_0.0625W_100PPM; Component Kind: Standard; Component Type: Standard; Pin Count: 2; Value: 10k; Status: Not Recommended; Power: 0.0625W; Manufacturer Part Number: R0402_10K_1%_0.0625W_100PPM; Case: 0402; Mounted: Yes; Sense: No; Socket: No; SMD: Yes; Manufacturer1 Example: YAGEO PHYCOMP; Manufacturer1 ComponentHeight: 0.4mm; HelpURL: \\cern.ch\dfs\Applications\Altium\Datasheets\R0402_Phycomp_RC0402.pdf; Author: CERN DEM JLC; CreateDate: 03.12.2007; LatestRevisionDate: 17.10.2012
R20 = R0603_20K5_0.1%_0.063W_10PPM: Resistor - 0.1%; Part Description: Thin Film Chip Resistor; Manufacturer: GENERIC; Manufacturer1 Part Number: RN73C1J20K5BTDF; Power: 0.063W; TC: ±10ppm; PressFit: No; Part Number: R0603_20K5_0.1%_0.063W_10PPM; Component Kind: Standard; Component Type: Standard; Pin Count: 2; Value: 20k5; Status: Not Recommended; Manufacturer Part Number: R0603_20K5_0.1%_0.063W_10PPM; Case: 0603; Mounted: Yes; Sense: No; Socket: No; SMD: Yes; Manufacturer1 Example: TYCO HOLSWORTHY; Manufacturer1 ComponentHeight: 0.5mm; HelpURL: \\cern.ch\dfs\Applications\Altium\Datasheets\R0603_Tyco_RN73.pdf; Author: CERN DEM JLC; CreateDate: 03.12.2007; LatestRevisionDate: 13.03.2008
R85 = R0402_0R_JUMPER: Resistor; Part Description: 1A (0.05R Max DC Resistance) Zero Ohm Jumper; Manufacturer: GENERIC; Manufacturer1 Part Number: 232270591001L; PressFit: No; Part Number: R0402_0R_JUMPER; Component Kind: Standard; Component Type: Standard; Pin Count: 2; Value: 0; Status: Not Recommended; Manufacturer Part Number: R0402_0R_JUMPER; Case: 0402; Mounted: Yes; Sense: No; Socket: No; SMD: Yes; Manufacturer1 Example: YAGEO PHYCOMP; Manufacturer1 ComponentHeight: 0.4mm; HelpURL: \\cern.ch\dfs\Applications\Altium\Datasheets\R0402_Phycomp_RC0402.pdf; Author: CERN DEM JLC; CreateDate: 03.12.2007; LatestRevisionDate: 17.10.2012
R87 = R0402_100K_1%_0.0625W_100PPM: Resistor - 1%; Part Description: General Purpose Thick Film Chip Resistor; Manufacturer: GENERIC; Manufacturer1 Part Number: 232270671004L; TC: ±100ppm/°C; PressFit: No; Part Number: R0402_100K_1%_0.0625W_100PPM; Component Kind: Standard; Component Type: Standard; Pin Count: 2; Value: 100k; Status: Not Recommended; Power: 0.0625W; Manufacturer Part Number: R0402_100K_1%_0.0625W_100PPM; Case: 0402; Mounted: Yes; Sense: No; Socket: No; SMD: Yes; Manufacturer1 Example: YAGEO PHYCOMP; Manufacturer1 ComponentHeight: 0.4mm; HelpURL: \\cern.ch\dfs\Applications\Altium\Datasheets\R0402_Phycomp_RC0402.pdf; Author: CERN DEM JLC; CreateDate: 03.12.2007; LatestRevisionDate: 17.10.2012